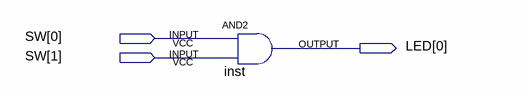
[diagram p0: schematic sheet]
// Quartus schematic task1.bdf as structural Verilog: 1 symbols, 3 pins
module task1 (
  input  [1:0] SW,
  output [0:0] LED
);

  and inst (LED[0], SW[0], SW[1]);
endmodule
